# EAGLE design PaxGeo_HallBoard (EAGLE 7.2.0)
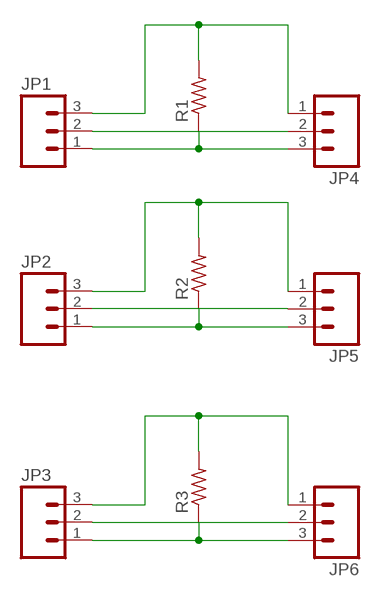
[diagram p0: schematic, sheet 1]

## Parts
JP1  M03SCREW  [SCREWTERMINAL-3.5MM-3]
JP2  M03SCREW  [SCREWTERMINAL-3.5MM-3]
JP3  M03SCREW  [SCREWTERMINAL-3.5MM-3]
JP4  M03SCREW  [SCREWTERMINAL-3.5MM-3]
JP5  M03SCREW  [SCREWTERMINAL-3.5MM-3]
JP6  M03SCREW  [SCREWTERMINAL-3.5MM-3]
R1  R-US_0204/7  [0204/7]
R2  R-US_0204/7  [0204/7]
R3  R-US_0204/7  [0204/7]

## Nets
N$1: JP1.3 JP4.1 R1.2
N$2: JP1.1 JP4.3 R1.1
N$3: JP1.2 JP4.2
N$4: JP2.2 JP5.2
N$5: JP2.3 JP5.1 R2.2
N$6: JP2.1 JP5.3 R2.1
N$7: JP3.2 JP6.2
N$8: JP3.3 JP6.1 R3.2
N$9: JP3.1 JP6.3 R3.1

## Library data of the parts
JP1-JP6 = SparkFun-Connectors:M03: Header 3 Standard 3-pin 0.1" header. Use with straight break away headers (SKU : PRT-00116), right angle break away headers (PRT-00553), swiss pins (PRT-00743), machine pins (PRT-00117), and female headers (PRT-00115). Molex polarized connector foot print use with SKU : PRT-08232 with associated crimp pins and housings.; PROD_ID: CONN-08288
R1-R3 = adafruit:R-US_: RESISTOR, American symbol

## Board
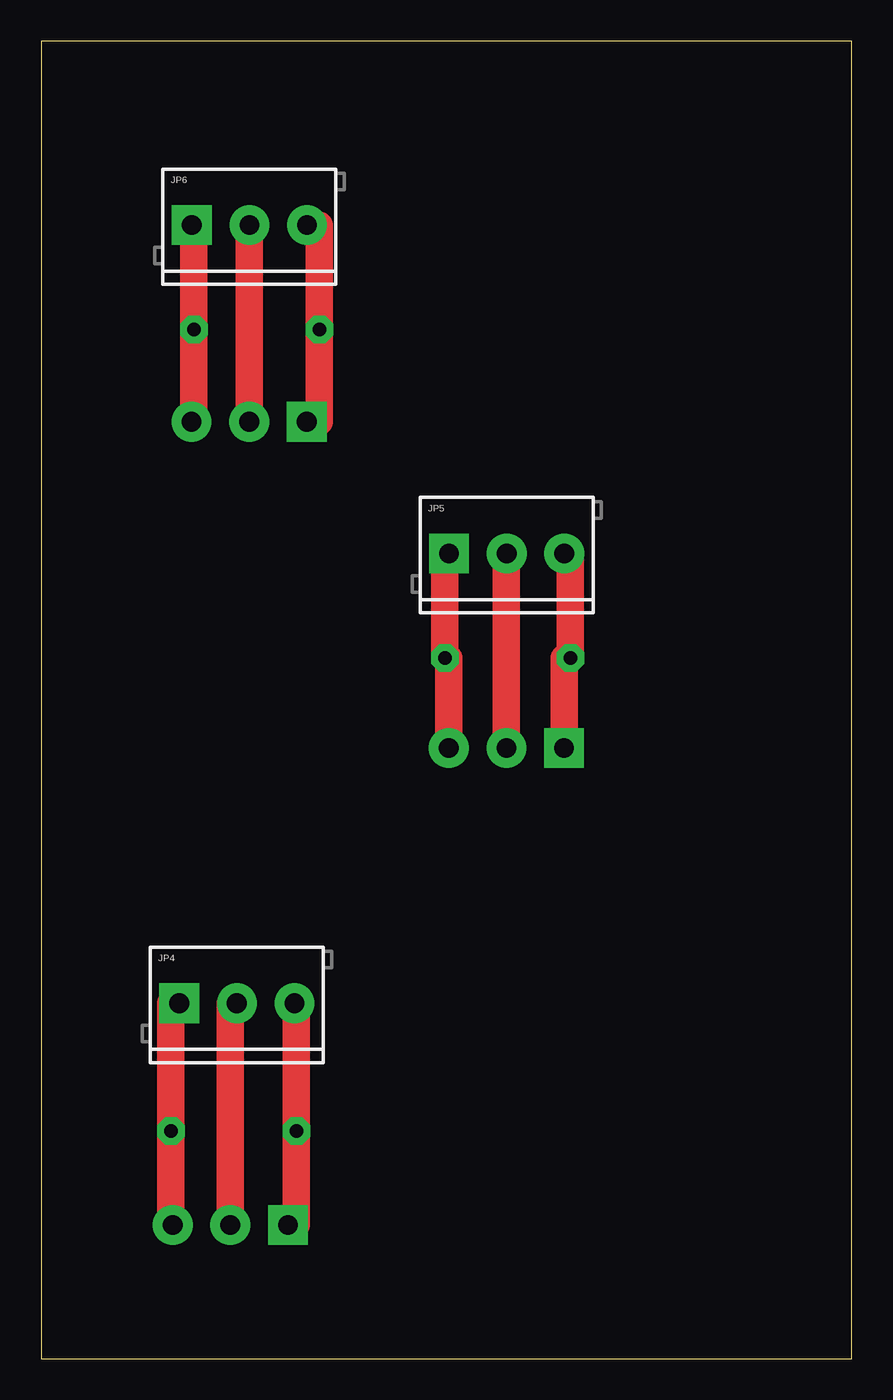
[diagram p1: board, top side]
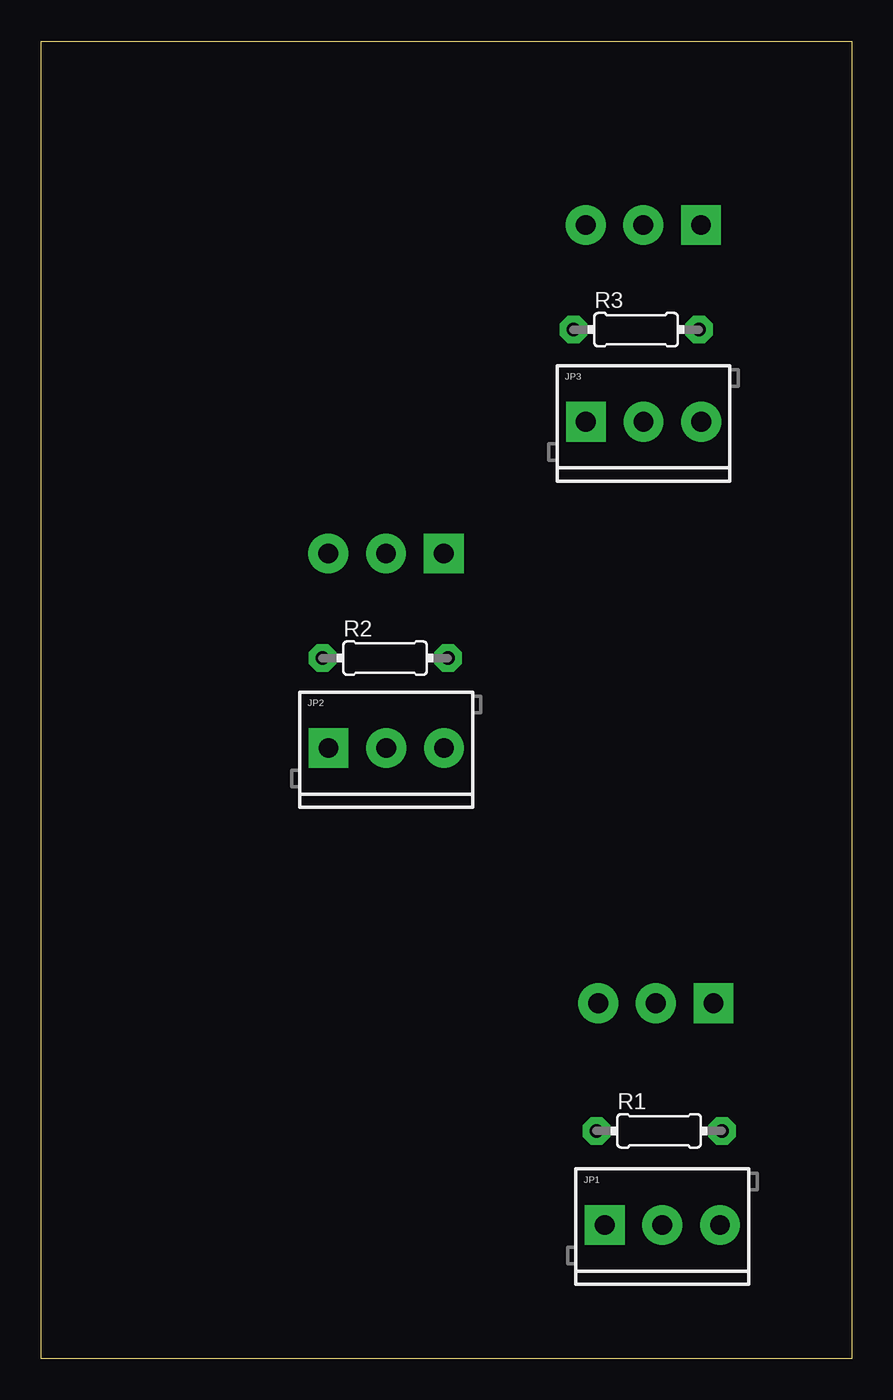
[diagram p2: board, bottom side, seen from below]

Size 49.2 x 80 mm. Coordinates in mm from the lower left corner, seen from the top.
Outline: 0,0 49.2,0 49.2,80 0,80 0,0
Copper layers (1*16): Top 0.035mm / dielectric 1.5mm / Bottom 0.035mm
Design rules "default": minimum track width 10mil, minimum drill 24mil, track to track 8mil, track to pad 8mil, pad to pad 8mil, via to via 8mil, smd to smd 8mil, copper to edge 40mil, drill to drill 8mil, minimum pad ring 10mil, minimum via ring 8mil, stop-mask expansion 4mil, vias tented up to drill 0mil, thermal gap 10mil

### Footprints (pad centres in the part's own frame; a part is rotated, then mirrored left to right if it is on the bottom)
SCREWTERMINAL-3.5MM-3 = drill 1.2 pad 2.413 square: 1 0,0 | drill 1.2 pad 2.413: 2 3.5,0; 3 7,0
0204/7 = drill 0.813 pad 1.676 octagon: 1 -3.81,0; 2 3.81,0

### Placement (x,y rotation side)
JP1  14.99,8.13 0 bottom
JP2  31.75,37.08 0 bottom
JP3  16.13,56.9 0 bottom
JP4  8.38,21.59 0 top
JP5  24.77,48.9 0 top
JP6  9.14,68.83 0 top
R1  11.68,13.84 0 bottom
R2  28.32,42.55 0 bottom
R3  13.08,62.48 0 bottom

### Tracks (layer width: path | path; a pad name or v marks a point on that pad's centre or on a via)
N$1
  Top 1.676: JP4.1 7.87,21.59 R1.2 7.87,8.13 JP1.3
N$2
  Top 1.676: JP4.3 15.49,21.59 R1.1 15.49,8.13 JP1.1
N$3
  Top 1.422: JP4.2 11.49,21.59
  Top 1.676: 11.49,21.59 JP1.2
N$4
  Top 1.676: JP5.2 28.25,48.9 JP2.2
N$5
  Top 1.676: JP5.1 24.51,48.9 R2.2 24.75,42.55 JP2.3
N$6
  Top 1.676: JP5.3 32.13,48.9 R2.1 31.75,42.55 JP2.1
N$7
  Top 1.676: JP6.2 12.63,68.83 JP3.2
N$8
  Top 1.676: JP6.1 9.27,68.83 R3.2 9.27,56.9 JP3.3
N$9
  Top 1.676: JP6.3 16.89,68.83 R3.1 16.89,56.9 JP3.1